# EAGLE design HUB_FPC (EAGLE 4.16)
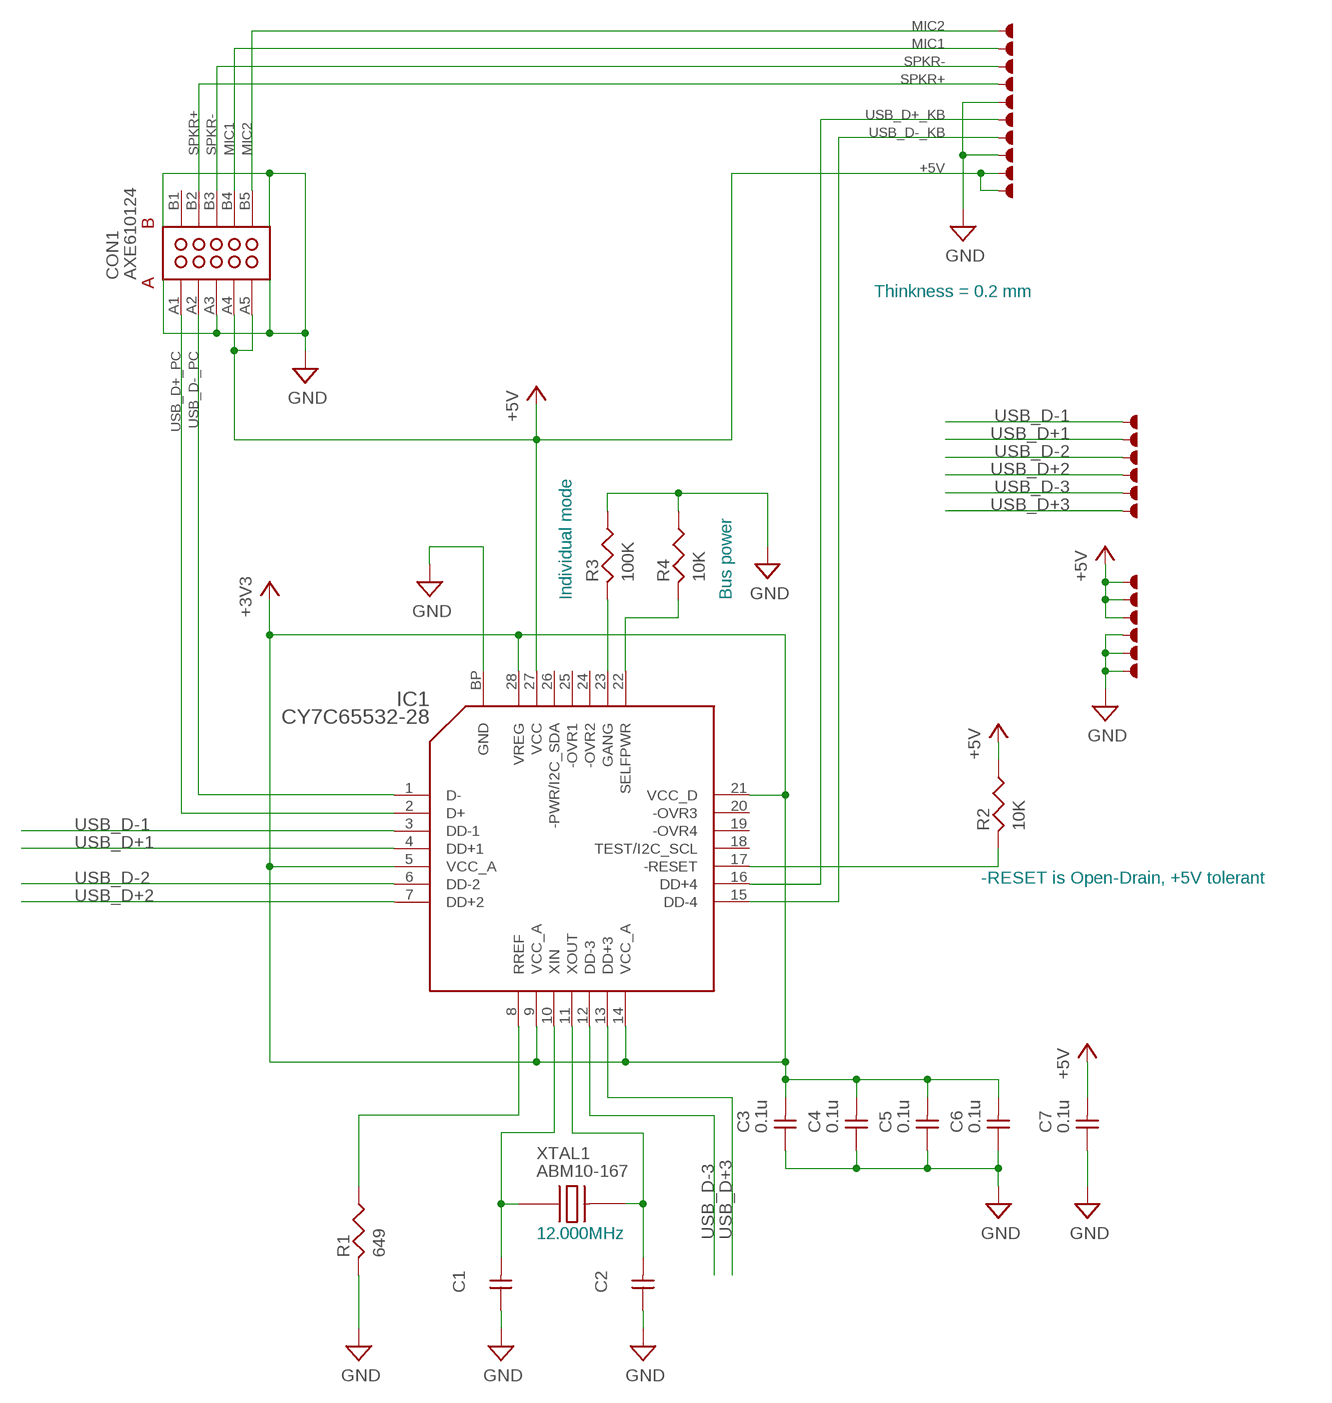
[diagram p0: schematic, sheet 1]

## Parts
C1  C1005  [1005]
C2  C1005  [1005]
C3  0.1u  C1005  [1005]
C4  0.1u  C1005  [1005]
C5  0.1u  C1005  [1005]
C6  0.1u  C1005  [1005]
C7  0.1u  C1005  [1005]
CON1  AXE610124  [AXE610*24]
IC1  CY7C65532-28  [QFN28BP]
PAD1  PAD(8X8)  [PAD_8X8]
PAD2  PAD(8X8)  [PAD_8X8]
PAD3  PAD(8X8)  [PAD_8X8]
PAD4  PAD(8X8)  [PAD_8X8]
PAD5  PAD(8X8)  [PAD_8X8]
PAD6  PAD(8X8)  [PAD_8X8]
PAD7  PAD(8X8)  [PAD_8X8]
PAD8  PAD(8X8)  [PAD_8X8]
PAD9  PAD(8X8)  [PAD_8X8]
PAD10  PAD(8X8)  [PAD_8X8]
PAD11  PAD(40X40)  [PAD_40X40]
PAD12  PAD(40X40)  [PAD_40X40]
PAD13  PAD(40X40)  [PAD_40X40]
PAD14  PAD(40X40)  [PAD_40X40]
PAD15  PAD(40X40)  [PAD_40X40]
PAD16  PAD(40X40)  [PAD_40X40]
PAD17  PAD(40X40)  [PAD_40X40]
PAD18  PAD(40X40)  [PAD_40X40]
PAD19  PAD(40X40)  [PAD_40X40]
PAD20  PAD(40X40)  [PAD_40X40]
PAD21  PAD(40X40)  [PAD_40X40]
PAD22  PAD(40X40)  [PAD_40X40]
R1  649  R1005  [1005]
R2  10K  R1005  [1005]
R3  100K  R1005  [1005]
R4  10K  R1005  [1005]
XTAL1  ABM10-167  XTAL2520X  [2520X]

## Nets
+3V3: C3.P$2 C4.P$2 C5.P$2 C6.P$2 IC1.5(VCC_A) IC1.9(VCC_A) IC1.14(VCC_A) IC1.21(VCC_D) IC1.28(VREG)
+5V: C7.P$2 CON1.A4 CON1.A5 IC1.27(VCC) PAD1.P PAD2.P PAD17.P PAD18.P PAD19.P R2.P$1
GND: C1.P$1 C2.P$1 C3.P$1 C4.P$1 C5.P$1 C6.P$1 C7.P$1 CON1.A3 CON1.GUIDE@L1(GUIDE) CON1.GUIDE@L2(GUIDE) CON1.GUIDE@R1(GUIDE) CON1.GUIDE@R2(GUIDE) IC1.BP(GND) PAD3.P PAD6.P PAD20.P PAD21.P PAD22.P R1.P$2 R3.P$1 R4.P$1
MIC1: CON1.B4 PAD9.P
MIC2: CON1.B5 PAD10.P
N$1: IC1.23(GANG) R3.P$2
N$2: C1.P$2 IC1.10(XIN) XTAL1.1(XTAL1)
N$3: C2.P$2 IC1.11(XOUT) XTAL1.3(XTAL2)
N$4: IC1.8(RREF) R1.P$1
N$5: IC1.17(-RESET) R2.P$2
N$7: IC1.22(SELFPWR) R4.P$2
SPKR+: CON1.B2 PAD7.P
SPKR-: CON1.B3 PAD8.P
USB_D+1: IC1.4(DD+1) PAD12.P
USB_D+2: IC1.7(DD+2) PAD14.P
USB_D+3: IC1.13(DD+3) PAD16.P
USB_D+_KB: IC1.16(DD+4) PAD5.P
USB_D+_PC: CON1.A1 IC1.2(D+)
USB_D-1: IC1.3(DD-1) PAD11.P
USB_D-2: IC1.6(DD-2) PAD13.P
USB_D-3: IC1.12(DD-3) PAD15.P
USB_D-_KB: IC1.15(DD-4) PAD4.P
USB_D-_PC: CON1.A2 IC1.1(D-)
Unconnected: CON1.B1 IC1.18(TEST/I2C_SCL) IC1.19(-OVR4) IC1.20(-OVR3) IC1.24(-OVR2) IC1.25(-OVR1) IC1.26(-PWR/I2C_SDA)

## Notes on the sheet
- Thinkness = 0.2 mm
- Individual mode | Bus power
- -RESET is Open-Drain, +5V tolerant
- 12.000MHz

## Library data of the parts
C1-C7 = additional:C: Capacitor (Non-Polar)
CON1 = additional:AXE610*24: Narrow pitch connectors A4S (0.4mm pitch) 10 pins
IC1 = main:CY7C6553*-28: CY7C65632-28, CY7C65634-28 HX2VL Very Low Power USB 2.0 Hub Controller 28 pin package CY7C65632-28 is 4 port version, and CY7C65634-28 is 2 port version.
PAD1-PAD22 = additional:PAD: PAD
R1-R4 = additional:R: Resistance
XTAL1 = additional:XTAL*: Xtal Oscillator

## Board
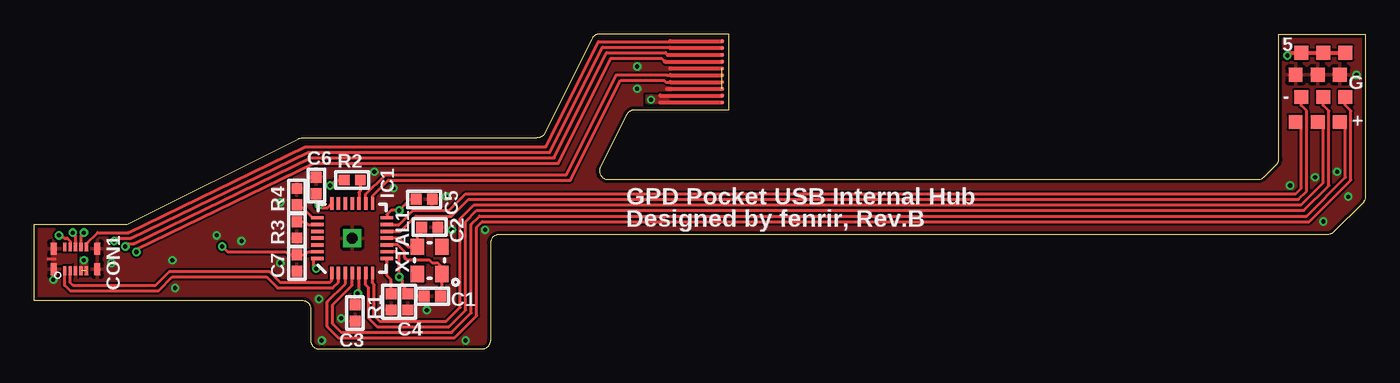
[diagram p1: board, top side]
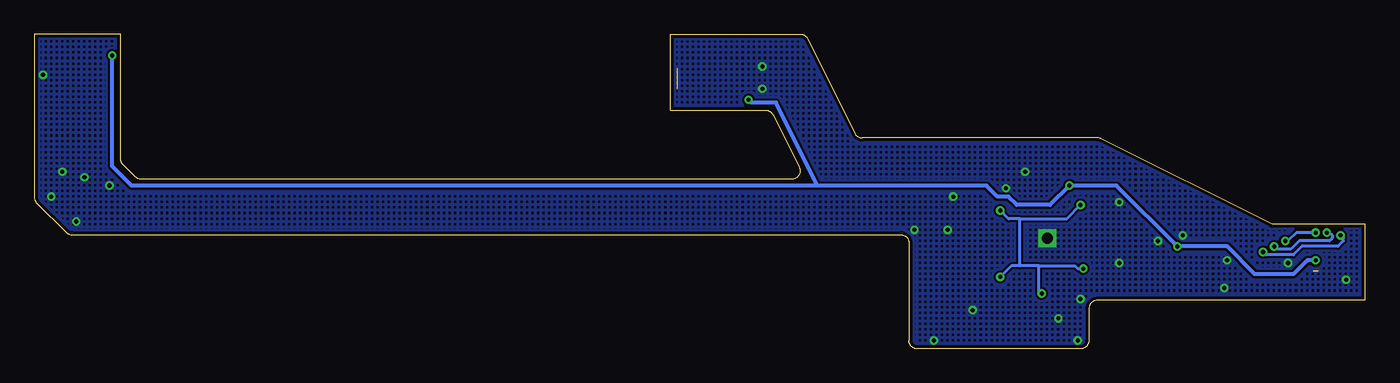
[diagram p2: board, bottom side, seen from below]

Size 97.79 x 23.11 mm. Coordinates in mm from the lower left corner, seen from the top.
Outline: 0,3.56 0,9.14 6.86,9.14 19.43,15.43 arc-27 19.7,15.49 36.96,15.49 arc63 37.51,15.83 40.98,22.78 arc-63 41.52,23.11 51.05,23.11 51.05,17.53 44.06,17.53 arc63 43.52,17.19 41.59,13.33 arc117 42.13,12.45 89.92,12.45 arc45 90.35,12.62 91.26,13.54 arc45 91.44,13.97 91.44,23.11 97.79,23.11 97.79,11.18 arc-45 97.61,10.74 95.43,8.56 arc-45 95,8.38 34.14,8.38 arc90 33.53,7.77 33.53,0.61 arc-90 32.92,0 20.93,0 arc-90 20.32,0.61 20.32,2.95 arc90 19.71,3.56 0,3.56
Copper layers (1*16): Top 0.035mm / dielectric 1.5mm / Bottom 0.035mm
Design rules "SeeedStudio_2layer_DRU_no_angle_20140221": minimum track width 6mil, minimum drill 12mil, track to track 6mil, track to pad 6mil, pad to pad 6mil, via to via 6mil, smd to smd 0mil, copper to edge 10mil, drill to drill 10mil, minimum pad ring 10mil, minimum via ring 6mil, stop-mask expansion 2mil, vias tented up to drill 100mil, thermal gap 10mil

### Footprints (pad centres in the part's own frame; a part is rotated, then mirrored left to right if it is on the bottom)
1005 = smd 0.8 x 0.8: P$1 -0.6,0; P$2 0.6,0
AXE610*24 = smd 0.23 x 0.65: A1 -0.8,-0.875; A2 -0.4,-0.875; A3 0,-0.875; A4 0.4,-0.875; A5 0.8,-0.875; B1 -0.8,0.875; B2 -0.4,0.875; B3 0,0.875; B4 0.4,0.875; B5 0.8,0.875 | smd 0.45 x 0.9: GUIDE@L1 -1.6,-0.75; GUIDE@L2 -1.6,0.75; GUIDE@R1 1.6,-0.75; GUIDE@R2 1.6,0.75
QFN28BP = smd 0.9 x 0.25: 1 -2.55,1.5; 2 -2.55,1; 3 -2.55,0.5; 4 -2.55,0; 5 -2.55,-0.5; 6 -2.55,-1; 7 -2.55,-1.5; 15 2.55,-1.5; 16 2.55,-1; 17 2.55,-0.5; 18 2.55,0; 19 2.55,0.5; 20 2.55,1; 21 2.55,1.5 | smd 0.25 x 0.9: 8 -1.5,-2.55; 9 -1,-2.55; 10 -0.5,-2.55; 11 0,-2.55; 12 0.5,-2.55; 13 1,-2.55; 14 1.5,-2.55; 22 1.5,2.55; 23 1,2.55; 24 0.5,2.55; 25 0,2.55; 26 -0.5,2.55; 27 -1,2.55; 28 -1.5,2.55 | drill 0.8 square: BP 0,0
PAD_8X8 = smd 0.203 x 0.203: P 0,0
PAD_40X40 = smd 1.016 x 1.016: P 0,0
2520X = smd 1.2 x 1: 1 -1,-0.9; 3 1,0.9; GND@2 1,-0.9; GND@4 -1,0.9

### Placement (x,y rotation side)
C1  29.26,3.86 0 top
C2  29.06,8.94 180 top
C3  23.57,2.64 90 top
C4  27.43,3.45 90 top
C5  28.65,10.97 180 top
C6  20.73,11.99 270 top
C7  19.3,6.3 90 top
CON1  3.05,6.6 0 top
IC1  23.37,8.13 90 top
PAD1  50.55,18.09 180 top
PAD2  50.55,18.59 180 top
PAD3  50.55,19.09 180 top
PAD4  50.55,19.59 180 top
PAD5  50.55,20.09 180 top
PAD6  50.55,20.59 180 top
PAD7  50.55,21.09 180 top
PAD8  50.55,21.59 180 top
PAD9  50.55,22.09 180 top
PAD10  50.55,22.59 180 top
PAD11  96.32,18.49 0 top
PAD12  95.91,16.66 0 top
PAD13  94.69,18.49 0 top
PAD14  94.28,16.66 0 top
PAD15  93.07,18.49 0 top
PAD16  92.66,16.66 0 top
PAD17  93.07,21.74 0 top
PAD18  94.69,21.74 0 top
PAD19  96.32,21.74 0 top
PAD20  92.66,20.12 0 top
PAD21  94.28,20.12 0 top
PAD22  95.91,20.12 0 top
R1  26.21,3.45 270 top
R2  23.37,12.4 0 top
R3  19.3,8.74 90 top
R4  19.3,11.18 270 top
XTAL1  29.06,6.5 90 top

### Tracks (layer width: path | path; a pad name or v marks a point on that pad's centre or on a via)
+3V3  (via drill 0.3)
  Top 0.203: IC1.9 26.6,7.13 26.82,6.91 v26.82,5.28 27.03,5.08 27.03,4.67 27.43,4.27 C4.P$2 | IC1.21 21.55,10.36 21.13,10.36 v20.93,10.57 20.73,10.77 C6.P$2 | IC1.5 23.87,4.16 v23.77,4.06 23.57,3.86 C3.P$2 | C5.P$2 27.64,10.97 v26.82,10.16 26.21,10.16 25.92,9.87 IC1.14 | IC1.28 20.65,6.63 20.52,6.5 20.52,6.1 v20.73,5.89
  Bottom 0.203: v20.93,10.57 21.95,9.55 25.4,9.55 | 25.4,9.55 26.21,9.55 v26.82,10.16 | v23.77,4.06 23.98,4.27 23.98,6.1 | 23.98,6.1 25.4,6.1 | 25.4,6.1 26.01,6.1 v26.82,5.28 | 25.4,6.1 25.4,9.55 | v20.73,5.89 21.13,5.89 21.34,6.1 23.98,6.1
+5V  (via drill 0.3)  (1 unrouted)
  Top 0.203: R2.P$1 22.15,12.39 v21.74,11.99 | IC1.27 20.13,7.13 19.9,6.9 C7.P$2 18.7,6.9 18.49,7.11 14.22,7.11 v13.82,7.52
  Top 0.305: 45.98,18.59 PAD2.P | 45.98,18.09 PAD1.P | v92.05,21.54 92.25,21.74 PAD17.P PAD18.P PAD19.P
  Bottom 0.305: v3.66,6.5 4.27,6.5 5.28,5.49 8.13,5.49 10.16,7.52 v13.82,7.52 18.29,11.99 v21.74,11.99 23.16,10.57 25.6,10.57 26.21,11.18 27.03,11.18 27.84,11.99 40.23,11.99 | 40.23,11.99 43.28,18.09 45.11,18.09 v45.31,18.29 | v92.05,21.54 92.05,13.41 90.63,11.99 40.23,11.99
  pour Top (no thermals): 3.45,5.89 3.45,6.71 3.86,6.71 3.86,5.89
  pour Top (no thermals): 46.53,18.59 46.53,18.08 45.01,18.08 45.01,18.59
GND  (via drill 0.3)  (1 unrouted)
  Top 0.203: 1.02,6.6 1.52,6.6
  Top 0.305: 46.75,20.59 PAD6.P | 46.49,19.09 PAD3.P
  other vias: 26.42,11.79 24.99,13 15.24,7.92 13.41,8.33 10.16,6.5 10.36,4.47 1.42,5.08 5.69,6.3 20.93,3.66 18.08,6.3 28.85,2.84 30.68,8.74 30.28,11.18 22.56,2.24 21.13,0.61 18.08,10.77 31.7,0.61 33.12,8.74 44.3,19.1 44.3,20.73 97.13,20.12 92.25,11.99 94.69,9.35 96.52,11.18 94.08,12.6 95.71,13
  pour Top (rank 2): 46.74,23.11 41.15,23.11 37.34,15.49 19.56,15.49 6.86,9.14 0,9.14 0,3.56 20.32,3.56 20.32,0 33.53,0 33.53,8.38 95.25,8.38 97.79,10.92 97.79,23.11 91.44,23.11 91.44,13.72 90.17,12.45 41.15,12.45 43.69,17.53 46.74,17.53
  pour Top (no thermals): 1.32,6.91 1.32,6.3 2.24,6.3 2.24,6.91
  pour Bottom (no thermals, hatched): 0,23.11 0,0 97.79,0 97.79,23.11
MIC1  (via drill 0.3)
  Top 0.203: CON1.B4 3.45,8.32 v3.66,8.53 | v5.89,7.92 6.1,8.13 7.11,8.13 20.12,14.43 37.9,14.43 41.76,22.15 46.69,22.15 46.75,22.09
  Top 0.305: 46.75,22.09 PAD9.P
  Bottom 0.203: v3.66,8.53 5.08,8.53 5.69,7.92 v5.89,7.92
MIC2
  Top 0.203: CON1.B5 3.85,7.71 4.67,8.53 6.91,8.53 19.91,14.83 37.59,14.83 41.45,22.55 46.71,22.55 46.75,22.59
  Top 0.305: 46.75,22.59 PAD10.P
N$1
  Top 0.203: IC1.23 20.13,9.13 19.92,9.34 R3.P$2
N$2
  Top 0.203: IC1.10 26.71,7.63 27.23,7.11 27.23,6.71 27.43,6.5 29.06,6.5 29.26,6.3 29.67,6.3 29.96,6.01 XTAL1.1 29.96,4.56 29.86,4.46 C1.P$2
N$3
  Top 0.203: IC1.11 26.82,8.13 27.45,7.5 XTAL1.3 28.16,8.24 28.46,8.54 C2.P$2
N$4
  Top 0.203: IC1.8 25.92,5.38 26.21,5.08 R1.P$1
N$5
  Top 0.203: IC1.17 23.87,11.47 23.97,11.57 R2.P$2
N$7
  Top 0.203: IC1.22 20.45,9.63 19.5,10.58 R4.P$2
SPKR+  (via drill 0.3)
  Top 0.203: CON1.B2 2.65,7.92 2.44,8.13 2.23,8.13 2.03,8.33 v1.83,8.33 | v7.52,7.11 7.52,7.32 20.52,13.61 38.51,13.61 42.37,21.34 46.09,21.34 46.34,21.09
  Top 0.305: 46.34,21.09 PAD7.P
  Bottom 0.203: v1.83,8.33 1.63,8.13 1.63,7.92 2.03,7.52 4.67,7.52 5.28,6.91 7.32,6.91 v7.52,7.11
SPKR-  (via drill 0.3)
  Top 0.203: CON1.B3 3.05,8.33 v2.85,8.53 | v6.71,7.52 6.91,7.72 7.32,7.72 20.32,14.02 38.2,14.02 42.06,21.74 46.39,21.74 46.54,21.59
  Top 0.305: 46.54,21.59 PAD8.P
  Bottom 0.203: v2.85,8.53 2.64,8.53 2.44,8.33 2.44,8.13 2.64,7.92 4.88,7.92 5.49,7.32 6.5,7.32 v6.71,7.52
USB_D+1
  Top 0.203: IC1.4 23.37,4.67 21.95,3.25 21.95,1.83 22.55,1.22 30.68,1.22 32.11,2.64 32.11,9.14 32.72,9.75 93.47,9.75 96.32,12.6 96.32,16.26 PAD12.P
USB_D+2
  Top 0.203: IC1.7 24.87,4.8 24.99,4.67 24.99,2.44 25.4,2.03 30.28,2.03 31.29,3.05 31.29,9.55 32.31,10.57 93.07,10.57 94.69,12.19 94.69,16.26 PAD14.P
USB_D+3
  Top 0.203: IC1.13 26.81,9.13 27.84,10.16 30.48,10.16 31.7,11.38 92.66,11.38 93.07,11.79 93.07,16.26 PAD16.P
USB_D+_KB
  Top 0.203: 46.75,20.09 46.51,20.09 46.48,20.12 42.77,20.12 39.12,12.8 25.81,12.8 24.37,11.36 IC1.16
  Top 0.305: 46.75,20.09 PAD5.P
USB_D+_PC
  Top 0.203: CON1.A1 2.25,4.66 2.64,4.27 9.14,4.27 10.16,5.28 17.07,5.28 17.88,4.47 21.95,4.47 22.37,4.89 IC1.2
USB_D-1
  Top 0.203: IC1.3 22.87,4.78 21.54,3.45 21.54,1.63 22.35,0.81 30.89,0.81 32.51,2.44 32.51,8.94 32.92,9.35 93.67,9.35 96.72,12.39 96.72,17.48 96.32,17.88 PAD11.P
USB_D-2
  Top 0.203: IC1.6 24.37,4.69 24.59,4.47 24.59,2.23 25.2,1.63 30.48,1.63 31.7,2.85 31.7,9.35 32.51,10.16 93.27,10.16 95.1,11.99 95.1,17.48 94.69,17.88 PAD13.P
USB_D-3
  Top 0.203: IC1.12 26.92,8.63 28.04,9.75 30.68,9.75 31.9,10.97 92.86,10.97 93.47,11.58 93.47,17.48 93.07,17.88 PAD15.P
USB_D-_KB
  Top 0.203: 46.75,19.59 46.4,19.59 46.28,19.71 43.08,19.71 39.42,12.39 26.01,12.39 24.87,11.25 IC1.15
  Top 0.305: 46.75,19.59 PAD4.P
USB_D-_PC
  Top 0.203: CON1.A2 2.65,4.87 2.85,4.67 8.94,4.67 9.96,5.69 17.27,5.69 18.09,4.88 21.74,4.88 21.87,5 IC1.1

### Text on the board
tPlace: 5 | G | - | +
tNames: GPD Pocket USB Internal Hub | Designed by fenrir, Rev.B
Description: Stiffener (0.1mm) | Stiffener (0.1mm) | Stiffener (0.25mm)